# EAGLE design CIRCUIT (EAGLE 9.6.2)
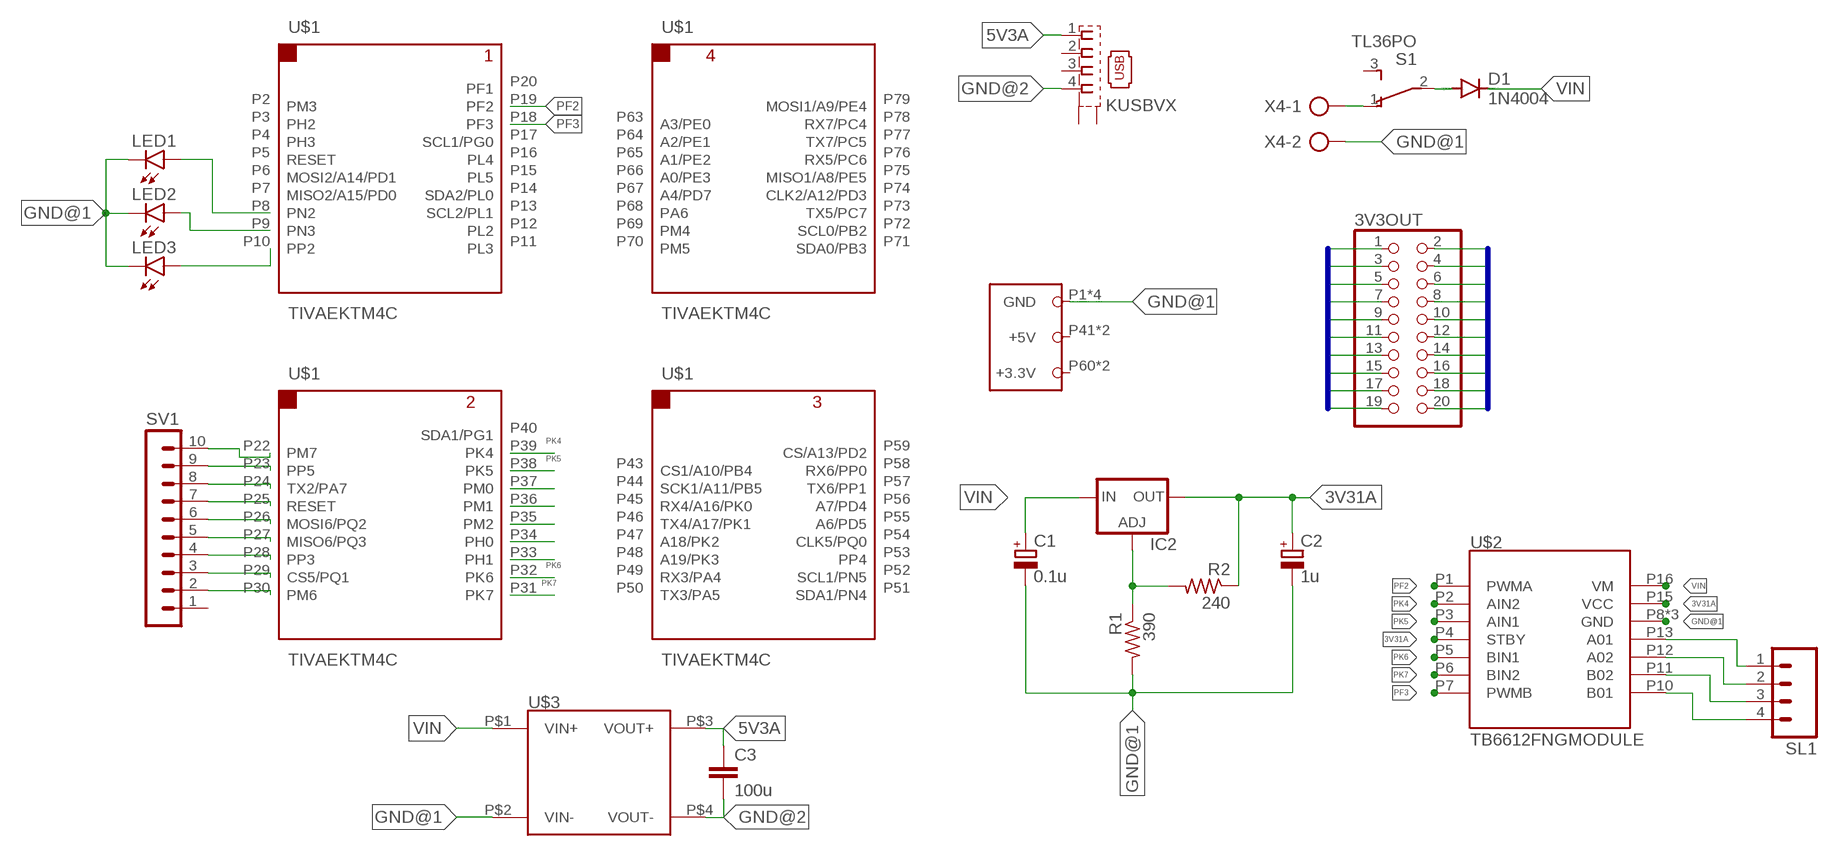
[diagram p0: schematic, sheet 1]

## Parts
3V3OUT  PINHD-2X10  [2X10]
C1  0.1u  CPOL-EUE5-10.5  [E5-10,5]
C2  1u  CPOL-EUE5-10.5  [E5-10,5]
C3  100u  C-EU025-024X044  [C025-024X044]
D1  1N4004  [DO41-10]
IC2  LM317TL  [317TL]
LED1  LED5MM  [LED5MM]
LED2  LED5MM  [LED5MM]
LED3  LED5MM  [LED5MM]
R1  390  R-US_0207/10  [0207/10]
R2  240  R-US_0207/10  [0207/10]
S1  TL36PO  [TL3XPO]
SL1  MA04  [04PA]
SV1  MA10-1  [MA10-1]
U$1  TIVAEKTM4C  [TIVAPINESPCB]
U$2  TB6612FNGMODULE  [TB6612FNG]
U$3  STEPDOWN3A  [REGULADORSTEP-DOWN3/5A]
X1  KUSBVX  [KUSBVX]
X4  AK300/2  [AK300/2]

## Nets
3V31A [outsVoltaje]: 3V3OUT.1 3V3OUT.3 3V3OUT.5 3V3OUT.7 3V3OUT.9 3V3OUT.11 3V3OUT.13 3V3OUT.15 3V3OUT.17 3V3OUT.19 C2.+ IC2.2(OUT) R2.1 U$2.P4(STBY) U$2.P15(VCC)
5V3A [5v3A]: C3.1 U$3.P$3(VOUT+) X1.1
GND@1 [outsVoltaje]: 3V3OUT.2 3V3OUT.4 3V3OUT.6 3V3OUT.8 3V3OUT.10 3V3OUT.12 3V3OUT.14 3V3OUT.16 3V3OUT.18 3V3OUT.20 LED1.K(C) LED2.K(C) LED3.K(C) U$1.P1(GND) U$1.P21(GND) U$1.P42(GND) U$1.P62(GND) U$2.P8(GND) U$2.P9(GND) U$2.P14(GND) U$3.P$2(VIN-) X4.2
GND@2 [5v3A]: C3.2 U$3.P$4(VOUT-) X1.4
N$1 [VInbat]: S1.1(O) X4.1
N$2 [VInbat]: D1.A S1.2(P)
N$3 [VInbat]: IC2.1(ADJ) R1.1 R2.2
N$4: LED3.A U$1.P10(PP2)
N$5: C1.- C2.- R1.2
N$7: LED2.A U$1.P9(PN3)
N$8: LED1.A U$1.P8(PN2)
N$9: SV1.10 U$1.P22(PM7)
N$10: SL1.1 U$2.P13(A01)
N$11: SL1.2 U$2.P12(A02)
N$12: U$1.P37(PM0)
N$13: U$1.P36(PM1)
N$14: U$1.P35(PM2)
N$15: U$1.P34(PH0)
N$16: U$1.P33(PH1)
N$17: SL1.3 U$2.P11(B02)
N$18: SL1.4 U$2.P10(B01)
N$19: SV1.9 U$1.P23(PP5)
N$20: SV1.8 U$1.P24(TX2/PA7)
N$21: SV1.7 U$1.P25(RESET)
N$22: SV1.6 U$1.P26(MOSI6/PQ2)
N$23: SV1.5 U$1.P27(MISO6/PQ3)
N$24: SV1.4 U$1.P28(PP3)
N$25: SV1.3 U$1.P29(CS5/PQ1)
N$26: SV1.2 U$1.P30(PM6)
PF2: U$1.P19(PF2) U$2.P1(PWMA)
PF3: U$1.P18(PF3) U$2.P7(PWMB)
PK4 [TivaPins]: U$1.P39(PK4) U$2.P2(AIN2)
PK5 [TivaPins]: U$1.P38(PK5) U$2.P3(AIN1)
PK6 [TivaPins]: U$1.P32(PK6) U$2.P5(BIN1)
PK7 [TivaPins]: U$1.P31(PK7) U$2.P6(BIN2)
VIN [VInbat]: C1.+ D1.C IC2.3(IN) U$2.P16(VM) U$3.P$1(VIN+)
Unconnected: S1.3(S) SV1.1 U$1.P2(PM3) U$1.P3(PH2) U$1.P4(PH3) U$1.P5(RESET) U$1.P6(MOSI2/A14/PD1) U$1.P7(MISO2/A15/PD0) U$1.P11(PL3) U$1.P12(PL2) U$1.P13(SCL2/PL1) U$1.P14(SDA2/PL0) U$1.P15(PL5) U$1.P16(PL4) U$1.P17(SCL1/PG0) U$1.P20(PF1) U$1.P40(SDA1/PG1) U$1.P41(+5V) U$1.P43(CS1/A10/PB4) U$1.P44(SCK1/A11/PB5) U$1.P45(RX4/A16/PK0) U$1.P46(TX4/A17/PK1) U$1.P47(A18/PK2) U$1.P48(A19/PK3) U$1.P49(RX3/PA4) U$1.P50(TX3/PA5) U$1.P51(SDA1/PN4) U$1.P52(SCL1/PN5) U$1.P53(PP4) U$1.P54(CLK5/PQ0) U$1.P55(A6/PD5) U$1.P56(A7/PD4) U$1.P57(TX6/PP1) U$1.P58(RX6/PP0) U$1.P59(CS/A13/PD2) U$1.P60(+3.3V) U$1.P61(+5V) U$1.P63(A3/PE0) U$1.P64(A2/PE1) U$1.P65(A1/PE2) U$1.P66(A0/PE3) U$1.P67(A4/PD7) U$1.P68(PA6) U$1.P69(PM4) U$1.P70(PM5) U$1.P71(SDA0/PB3) U$1.P72(SCL0/PB2) U$1.P73(TX5/PC7) U$1.P74(CLK2/A12/PD3) U$1.P75(MISO1/A8/PE5) U$1.P76(RX5/PC6) U$1.P77(TX7/PC5) U$1.P78(RX7/PC4) U$1.P79(MOSI1/A9/PE4) U$1.P80(+3.3V) X1.2 X1.3 X1.M1(S1) X1.M2(S2)

## Buses
GNDS:GND@1
3V31AS:3V31A

## Library data of the parts
3V3OUT = pinhead:PINHD-2X10: PIN HEADER
C1 C2 = rcl:CPOL-EU: POLARIZED CAPACITOR, European symbol; SPICEPREFIX: C
C3 = rcl:C-EU: CAPACITOR, European symbol; SPICEPREFIX: C
D1 = diode:1N4004: DIODE general purpose rectifier, 1 A
IC2 = v-reg:LM317TL: VOLTAGE REGULATOR
LED1-LED3 = led:LED: LED OSRAM: - CHIPLED LG R971, LG N971, LY N971, LG Q971, LY Q971, LO R971, LY R971 LH N974, LH R974 LS Q976, LO Q976, LY Q976 LO Q996 - Hyper CHIPLED LW Q18S LB Q993, LB Q99A, LB R99A - SideLED LS A670, LO A670, LY A670, LG A670, LP A670 LB A673, LV A673, LT A673, LW A673 LH A674 LY A675 LS A676, LA A676, LO A676, LY A676, LW A676 LS A679, LY A679, LG A679 - Hyper Micro SIDELED® LS Y876, LA Y876, LO Y876, LY Y876 LT Y87S - SmartLED LW L88C, LW L88S LB L89C, LB L89S, LG L890 LS L89K, LO L89K, LY L89K LS L896, LA L896, LO L896, LY L896 - TOPLED LS T670, LO T670, LY T670, LG T670, LP T670 LSG T670, LSP T670, LSY T670, LOP T670, LYG T670 LG T671, LOG T671, LSG T671 LB T673, LV T673, LT T673, LW T673 LH T674 LS T676, LA T676, LO T676, LY T676, LB T676, LH T676, LSB T676, LW T676 LB T67C, LV T67C, LT T67C, LS T67K, LO T67K, LY T67K, LW E67C LS E67B, LA E67B, LO E67B, LY E67B, LB E67C, LV E67C, LT E67C LW T67C LS T679, LY T679, LG T679 LS T770, LO T770, LY T770, LG T770, LP T770 LB T773, LV T773, LT T773, LW T773 LH T774 LS E675, LA E675, LY E675, LS T675 LS T776, LA T776, LO T776, LY T776, LB T776 LHGB T686 LT T68C, LB T68C - Hyper Mini TOPLED® LB M676 - Mini TOPLED Santana® LG M470 LS M47K, LO M47K, LY M47K Source: http://www.osram.convergy.de LUXEON: - LUMILED® LXK2-PW12-R00, LXK2-PW12-S00, LXK2-PW14-U00, LXK2-PW14-V00 LXK2-PM12-R00, LXK2-PM12-S00, LXK2-PM14-U00 LXK2-PE12-Q00, LXK2-PE12-R00, LXK2-PE12-S00, LXK2-PE14-T00, LXK2-PE14-U00 LXK2-PB12-K00, LXK2-PB12-L00, LXK2-PB12-M00, LXK2-PB14-N00, LXK2-PB14-P00, LXK2-PB14-Q00 LXK2-PR12-L00, LXK2-PR12-M00, LXK2-PR14-Q00, LXK2-PR14-R00 LXK2-PD12-Q00, LXK2-PD12-R00, LXK2-PD12-S00 LXK2-PH12-R00, LXK2-PH12-S00 LXK2-PL12-P00, LXK2-PL12-Q00, LXK2-PL12-R00 Source: www.luxeon.com KINGBRIGHT: KA-3528ASYC Source: www.kingbright.com
R1 R2 = rcl:R-US_: RESISTOR, American symbol; SPICEPREFIX: R
S1 = switch:TL36PO: TINY SWITCH ON - ON Source: http://www2.produktinfo.conrad.com/datenblaetter/700000-724999/705152-da-01-de-Subminiaturschalter_TL_36YO.pdf
SL1 = con-amp-quick:MA04: AMP QUICK CONNECTOR; OC_FARNELL: unknown; OC_NEWARK: unknown
SV1 = con-lstb:MA10-1: PIN HEADER; OC_FARNELL: unknown; OC_NEWARK: unknown
U$1 = TivaConnector:TIVAEKTM4C
U$2 = Drivers:TB6612FNGMODULE
U$3 = ReguladoresStep:STEPDOWN3A
X1 = con-kycon:KUSBVX: Vertical,Top Entry Universal Serial Bus Connector KUSBVX Series Source: KYCON Sibalco USB vertical socket KUSBV.pdf
X4 = con-ptr500:AK300/2: CONNECTOR; OC_FARNELL: unknown; OC_NEWARK: unknown

## Net classes
0 default: width 0.381 mm, drill 0.203 mm, clearance 1.27 mm
1 RasPins: drill 8 mm, clearance 1.27 mm
2 TivaPins: width 0.381 mm, drill 0.203 mm, clearance 1.27 mm
3 VInbat: width 1.27 mm, drill 0.406 mm, clearance 1.27 mm
4 5v3A: width 1.27 mm, drill 0.508 mm, clearance 1.27 mm
5 outsVoltaje: width 0.635 mm, drill 0.203 mm, clearance 1.27 mm

## Board
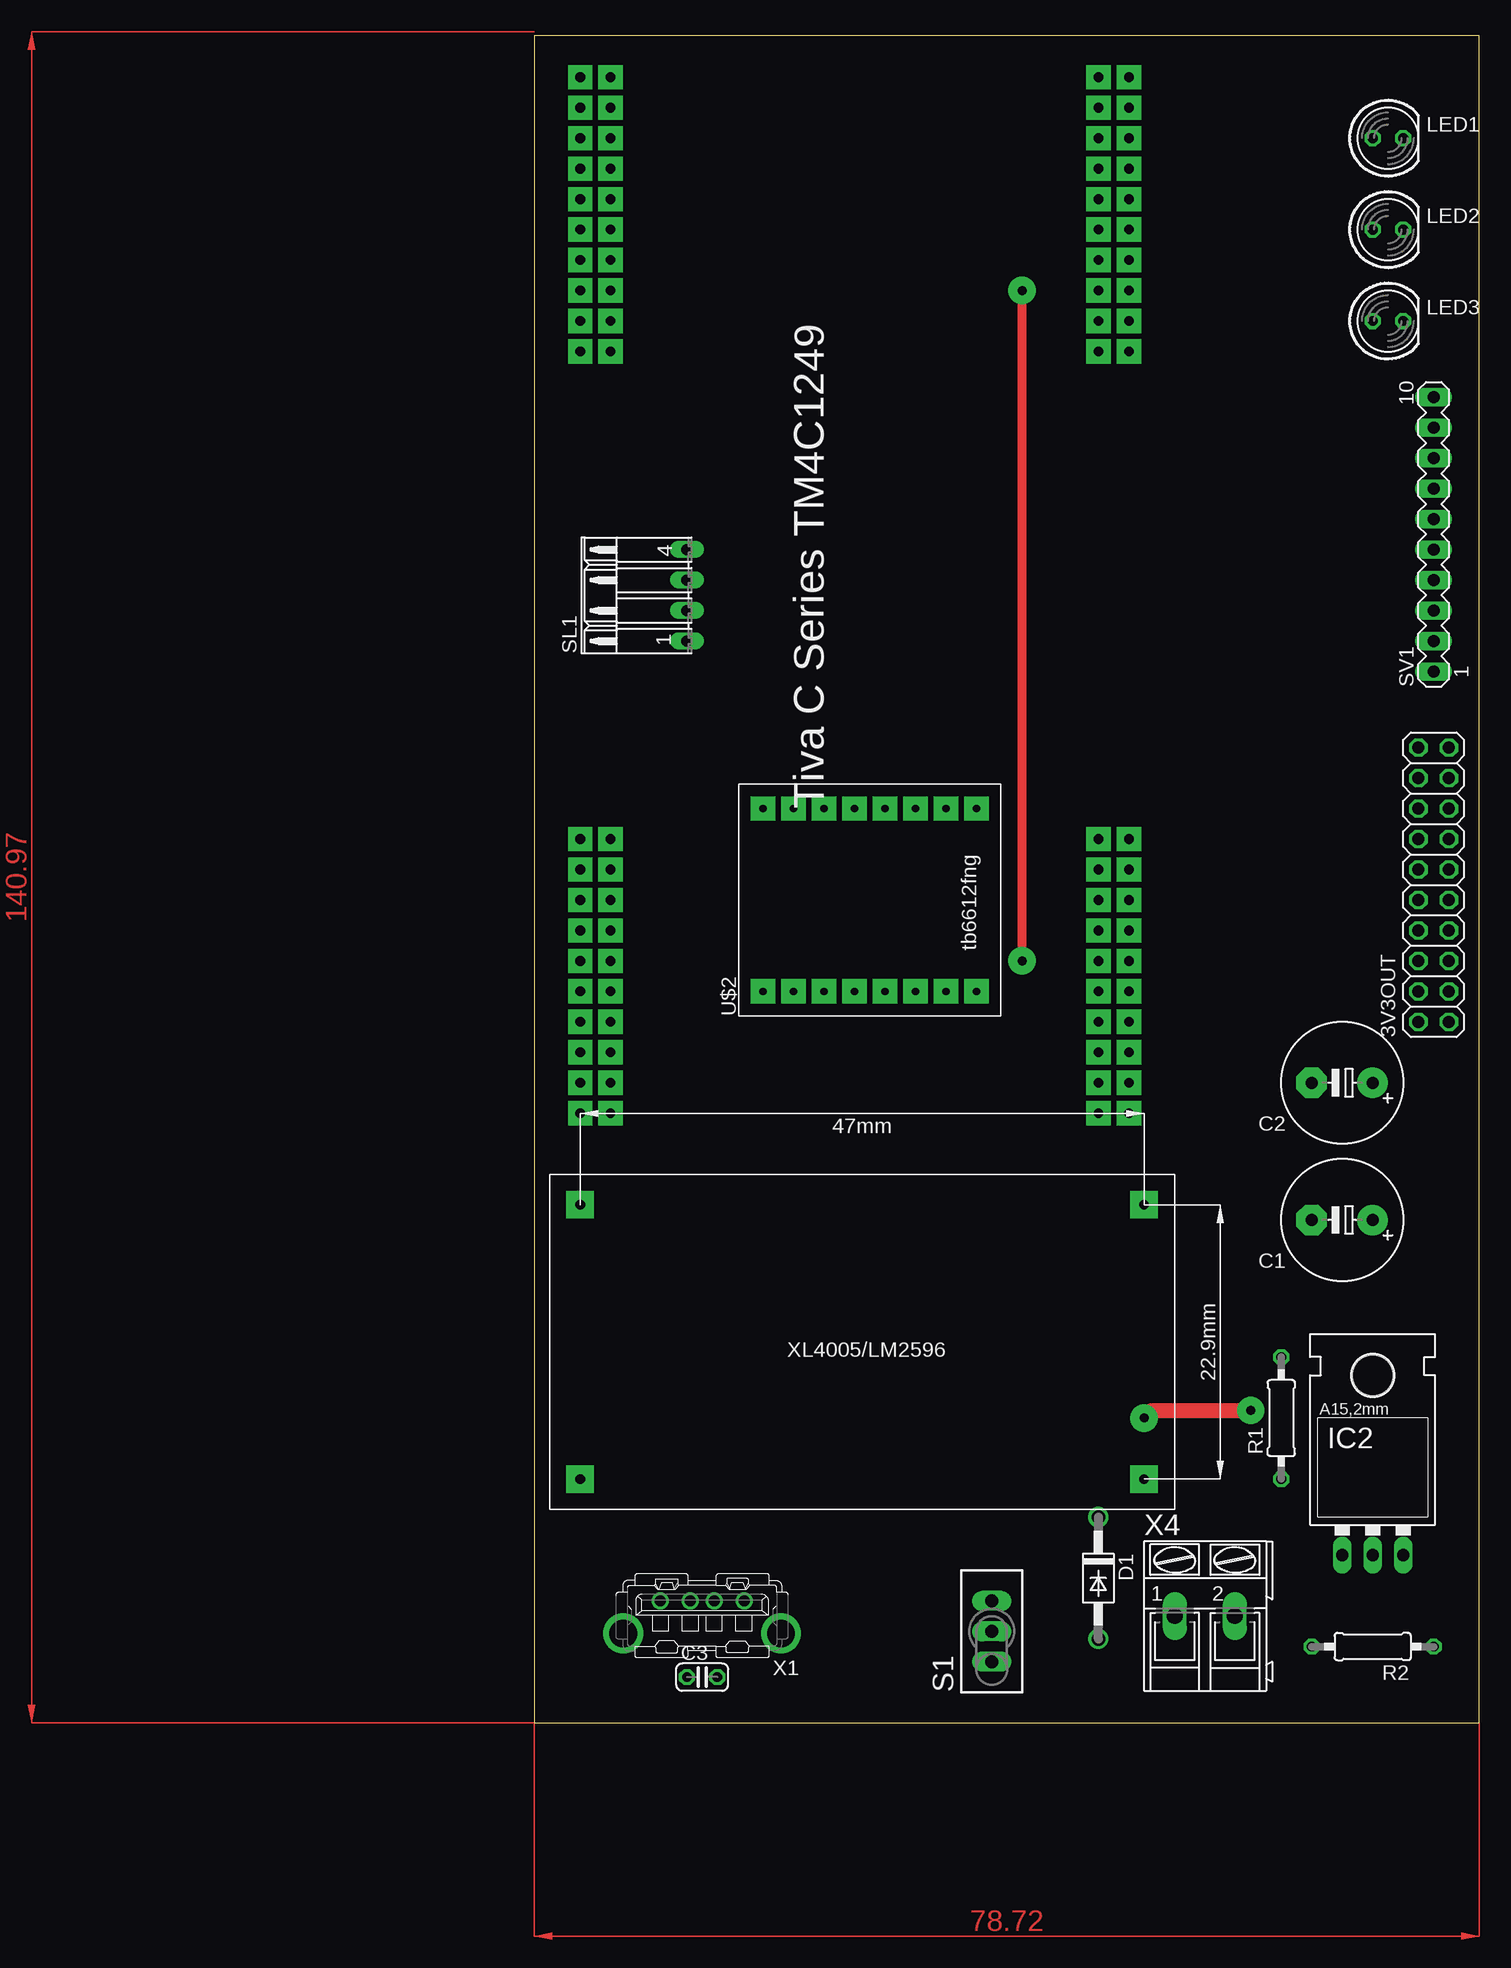
[diagram p1: board, top side]
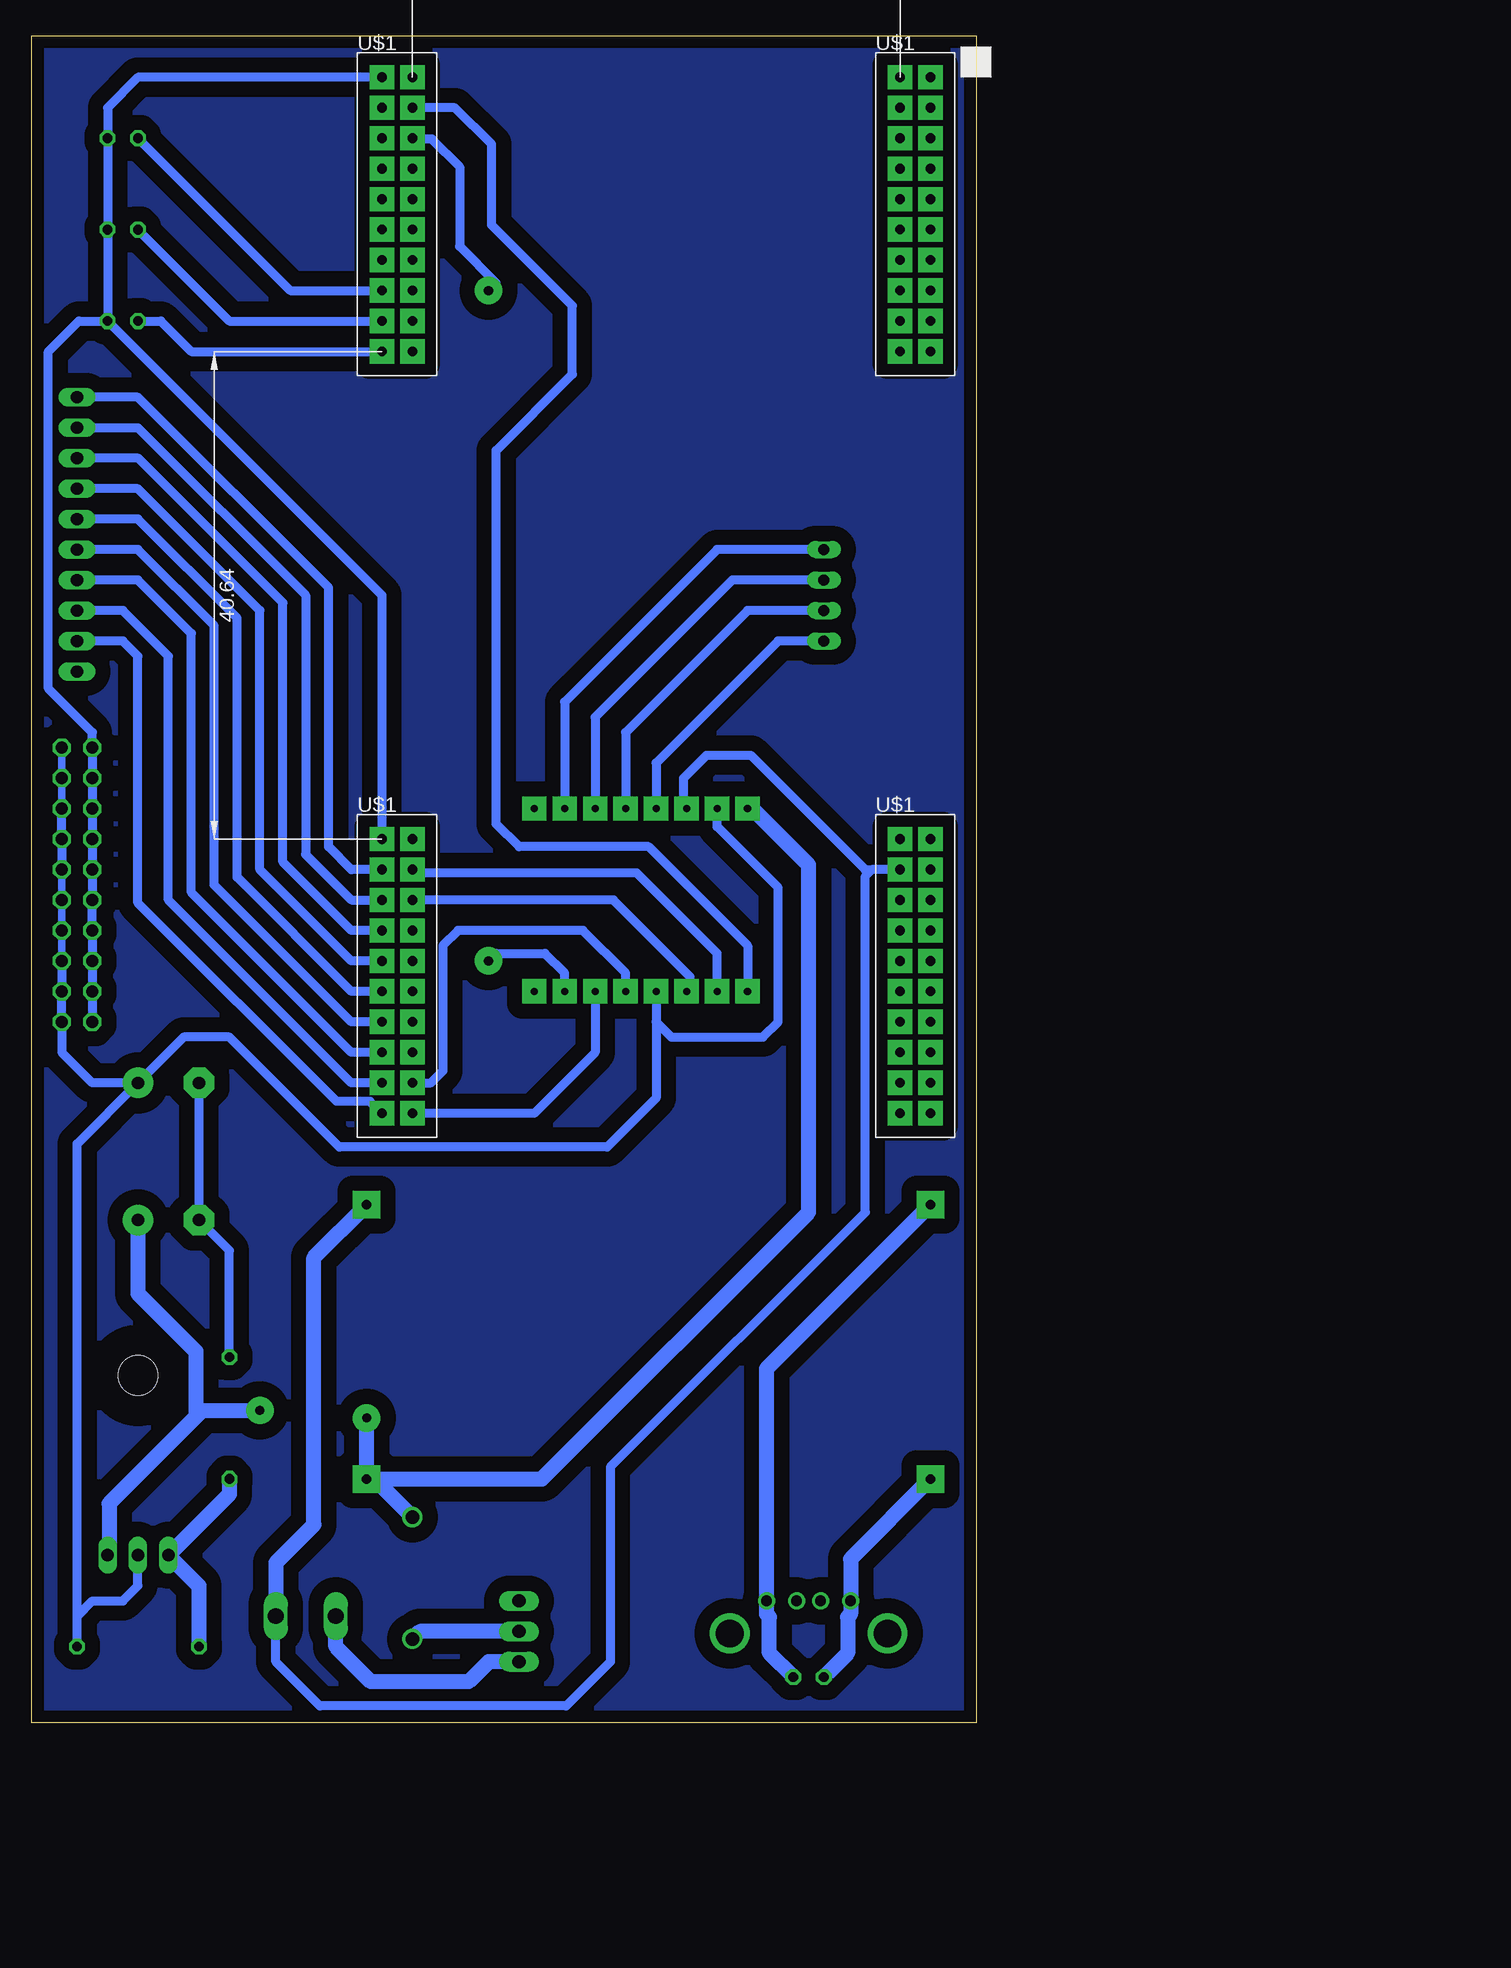
[diagram p2: board, bottom side, seen from below]

Size 78.72 x 140.64 mm. Coordinates in mm from the lower left corner, seen from the top.
Outline: 0,0 78.72,0 78.72,140.64 0,140.64 0,0
Copper layers (1*16): Top 0.035mm / dielectric 1.5mm / Bottom 0.035mm
Design rules "default": minimum track width 6mil, minimum drill 0.35mm, track to track 6mil, track to pad 6mil, pad to pad 6mil, via to via 6mil, smd to smd 6mil, copper to edge 40mil, drill to drill 6mil, minimum pad ring 10mil, minimum via ring 8mil, stop-mask expansion 4mil, vias tented up to drill 0mil, thermal gap 10mil

### Footprints (pad centres in the part's own frame; a part is rotated, then mirrored left to right if it is on the bottom)
2X10 = drill 1.016 octagon: 1 -11.43,-1.27; 2 -11.43,1.27; 3 -8.89,-1.27; 4 -8.89,1.27; 5 -6.35,-1.27; 6 -6.35,1.27; 7 -3.81,-1.27; 8 -3.81,1.27; 9 -1.27,-1.27; 10 -1.27,1.27; 11 1.27,-1.27; 12 1.27,1.27; 13 3.81,-1.27; 14 3.81,1.27; 15 6.35,-1.27; 16 6.35,1.27; 17 8.89,-1.27; 18 8.89,1.27; 19 11.43,-1.27; 20 11.43,1.27
E5-10,5 = drill 1.016 pad 2.54: + -2.54,0 | drill 1.016 pad 2.54 octagon: - 2.54,0
C025-024X044 = drill 0.813 octagon: 1 -1.27,0; 2 1.27,0
DO41-10 = drill 1.118: A 5.08,0; C -5.08,0
317TL = drill 1.016 long: 1 -2.54,-3.81; 2 0,-3.81; 3 2.54,-3.81 | hole 3.302: 0,11.176
LED5MM = drill 0.813 octagon: A -1.27,0; K 1.27,0
0207/10 = drill 0.813 octagon: 1 -5.08,0; 2 5.08,0
TL3XPO = drill 1.1 pad 1.422 long: 1 -2.54,0; 2 0,0; 3 2.54,0
04PA = drill 0.914 long: 1 -3.81,0; 2 -1.27,0; 3 1.27,0; 4 3.81,0
MA10-1 = drill 1.016 long: 1 -11.43,0; 2 -8.89,0; 3 -6.35,0; 4 -3.81,0; 5 -1.27,0; 6 1.27,0; 7 3.81,0; 8 6.35,0; 9 8.89,0; 10 11.43,0
TIVAPINESPCB = drill 0.8 pad 2.032 square: P1 -1.27,11.43; P2 -1.27,8.89; P3 -1.27,6.35; P4 -1.27,3.81; P5 -1.27,1.27; P6 -1.27,-1.27; P7 -1.27,-3.81; P8 -1.27,-6.35; P9 -1.27,-8.89; P10 -1.27,-11.43; P11 1.27,-11.43; P12 1.27,-8.89; P13 1.27,-6.35; P14 1.27,-3.81; P15 1.27,-1.27; P16 1.27,1.27; P17 1.27,3.81; P18 1.27,6.35; P19 1.27,8.89; P20 1.27,11.43; P21 -1.27,-52.07; P22 -1.27,-54.61; P23 -1.27,-57.15; P24 -1.27,-59.69; P25 -1.27,-62.23; P26 -1.27,-64.77; P27 -1.27,-67.31; P28 -1.27,-69.85; P29 -1.27,-72.39; P30 -1.27,-74.93; P31 1.27,-74.93; P32 1.27,-72.39; P33 1.27,-69.85; P34 1.27,-67.31; P35 1.27,-64.77; P36 1.27,-62.23; P37 1.27,-59.69; P38 1.27,-57.15; P39 1.27,-54.61; P40 1.27,-52.07; P41 41.91,-52.07; P42 41.91,-54.61; P43 41.91,-57.15; P44 41.91,-59.69; P45 41.91,-62.23; P46 41.91,-64.77; P47 41.91,-67.31; P48 41.91,-69.85; P49 41.91,-72.39; P50 41.91,-74.93; P51 44.45,-74.93; P52 44.45,-72.39; P53 44.45,-69.85; P54 44.45,-67.31; P55 44.45,-64.77; P56 44.45,-62.23; P57 44.45,-59.69; P58 44.45,-57.15; P59 44.45,-54.61; P60 44.45,-52.07; P61 41.91,11.43; P62 41.91,8.89; P63 41.91,6.35; P64 41.91,3.81; P65 41.91,1.27; P66 41.91,-1.27; P67 41.91,-3.81; P68 41.91,-6.35; P69 41.91,-8.89; P70 41.91,-11.43; P71 44.45,-11.43; P72 44.45,-8.89; P73 44.45,-6.35; P74 44.45,-3.81; P75 44.45,-1.27; P76 44.45,1.27; P77 44.45,3.81; P78 44.45,6.35; P79 44.45,8.89; P80 44.45,11.43
TB6612FNG = drill 0.6 pad 2.032 square: P1 -7.62,8.89; P2 -7.62,6.35; P3 -7.62,3.81; P4 -7.62,1.27; P5 -7.62,-1.27; P6 -7.62,-3.81; P7 -7.62,-6.35; P8 -7.62,-8.89; P9 7.62,-8.89; P10 7.62,-6.35; P11 7.62,-3.81; P12 7.62,-1.27; P13 7.62,1.27; P14 7.62,3.81; P15 7.62,6.35; P16 7.62,8.89
REGULADORSTEP-DOWN3/5A = drill 0.8 pad 2.286 square: P$1 0,0; P$2 0,-22.86; P$3 46.99,0; P$4 46.99,-22.86
KUSBVX = drill 0.9 pad 1.3: 1 3.5,0; 2 1,0; 3 -1,0; 4 -3.5,0 | drill 2.3 pad 2.8: M1 -6.57,2.71; M2 6.57,2.71
AK300/2 = drill 1.321 long: 1 -2.515,0; 2 2.489,0

### Placement (x,y rotation side)
3V3OUT  74.93,69.85 90 top
C1  67.31,41.91 180 top
C2  67.31,53.34 180 top
C3  13.97,3.81 0 top
D1  46.99,12.06 270 top
IC2  69.85,17.78 0 top
LED1  71.12,132.08 0 top
LED2  71.12,124.46 0 top
LED3  71.12,116.84 0 top
R1  62.23,25.4 90 top
R2  69.85,6.35 180 top
S1  38.1,7.62 90 top
SL1  12.7,93.98 90 top
SV1  74.93,99.06 90 top
U$1  48.26,125.73 0 bottom
U$2  27.94,68.58 90 top
U$3  50.8,20.32 180 top
X1  13.97,10.16 180 top
X4  55.88,8.89 0 top

### Tracks (layer width: path | path; a pad name or v marks a point on that pad's centre or on a via)
3V31A
  Bottom 0.635: 3V3OUT.15 3V3OUT.17 3V3OUT.19 | 3V3OUT.11 3V3OUT.9 3V3OUT.7 3V3OUT.5
  Bottom 0.762: R2.1 74.93,8.89 | 74.93,8.89 73.66,10.16 71.12,10.16 69.85,11.43 IC2.2 | 74.93,8.89 74.93,48.26 C2.+ | C2.+ 73.66,53.34 76.2,55.88 3V3OUT.1 3V3OUT.3 3V3OUT.5 | 3V3OUT.11 3V3OUT.13 3V3OUT.15 | U$2.P15 21.59,74.68 16.51,69.6 16.51,58.42 17.78,57.15 25.4,57.15 26.67,58.42 U$2.P4 26.67,52.07 30.76,47.98 53.06,47.98 62.23,57.15 66.04,57.15 C2.+
5V3A
  Bottom 0.762: 12.38,4.13 C3.1
  Bottom 1.27: U$3.P$3 10.47,13.66 X1.1 10.47,9.06 10.71,8.82 10.71,5.8 12.38,4.13
DISIPATE
  pour Bottom: 0,140.97 78.74,140.97 78.74,0 0,0
GND@1
  Bottom 0.762: 3V3OUT.2 3V3OUT.4 3V3OUT.6 3V3OUT.8 3V3OUT.10 3V3OUT.12 3V3OUT.14 3V3OUT.16 3V3OUT.18 3V3OUT.20 73.66,82.55 77.32,86.21 77.32,114.3 74.78,116.84 LED3.K | U$1.P1 69.85,137.16 72.39,134.62 LED1.K LED2.K LED3.K | U$2.P14 24.41,76.48 24.41,78.71 22.45,80.66 18.8,80.66 9.26,71.12 8.7,71.12 | LED3.K 49.53,93.98 U$1.P21 | X4.2 58.37,5.08 54.69,1.4 34.16,1.4 30.48,5.08 30.48,21.31 9.25,42.55 9.25,70.58 8.7,71.12 | U$1.P42 8.7,71.12
  Bottom 1.27: X4.2 58.37,13.33 55.19,16.51 55.19,38.79 U$3.P$2
GND@2
  Bottom 1.27: C3.2 17.23,5.8 17.23,8.82 17.47,9.06 X1.4 17.47,29.52 U$3.P$4
N$1
  Bottom 1.27: S1.1 40.64,5.08 42.29,3.43 50.44,3.43 53.36,6.35 X4.1
N$2
  Bottom 1.27: S1.2 46.35,7.62 D1.A
N$3
  Bottom 1.27: R1.1 62.23,19.05 IC2.1 64.77,11.43 R2.2
N$4
  Bottom 0.762: LED3.A 67.94,116.84 65.41,114.3 U$1.P10
N$5
  Bottom 0.762: C2.- C1.- 62.23,39.37 R1.2
N$7
  Bottom 0.762: LED2.A 62.23,116.84 U$1.P9
N$8
  Bottom 0.762: LED1.A 57.15,119.38 U$1.P8
N$9
  Bottom 0.762: U$1.P22 52.07,71.12 53.97,73.03 53.97,94.61 69.85,110.49 SV1.10
N$10
  Bottom 0.762: SL1.1 16.51,90.17 26.67,80.01 U$2.P13
N$11
  Bottom 0.762: SL1.2 19.05,92.71 29.21,82.55 U$2.P12
N$17
  Bottom 0.762: SL1.3 20.32,95.25 31.75,83.82 U$2.P11
N$18
  Bottom 0.762: SL1.4 21.59,97.79 34.29,85.09 U$2.P10
N$19
  Bottom 0.762: SV1.9 69.85,107.95 55.88,93.98 55.88,72.39 52.07,68.58 U$1.P23
N$20
  Bottom 0.762: U$1.P24 52.07,66.04 57.78,71.75 57.78,93.37 69.83,105.41 SV1.8
N$21
  Bottom 0.762: U$1.P25 52.07,63.5 59.69,71.12 59.69,92.71 69.85,102.87 SV1.7
N$22
  Bottom 0.762: U$1.P26 52.07,60.96 61.59,70.48 61.59,92.08 69.85,100.33 SV1.6
N$23
  Bottom 0.762: U$1.P27 52.07,58.42 63.5,69.85 63.5,91.44 69.85,97.79 SV1.5
N$24
  Bottom 0.762: SV1.4 69.85,95.25 65.41,90.81 65.41,69.22 52.07,55.88 U$1.P28
N$25
  Bottom 0.762: U$1.P29 52.07,53.34 67.31,68.58 67.31,88.9 71.12,92.71 SV1.3
N$26
  Bottom 0.762: U$1.P30 50.52,51.79 53.31,51.79 69.85,68.33 69.85,88.9 71.12,90.17 SV1.2
PF2
  Bottom 0.762: U$2.P1 19.05,64.77 27.3,73.03 38.1,73.03 40,74.93 40,106.05 33.66,112.39 33.66,118.11 40.39,124.84 40.39,131.57 43.43,134.62 U$1.P19
PF3  (via drill 0.76 pad 2.29)
  Top 0.762: v40.64,63.5 v40.64,119.38
  Bottom 0.381: 46.93,132.02 U$1.P18
  Bottom 0.762: v40.64,119.38 40,120.02 43.05,123.06 43.05,129.7 45.37,132.02 46.93,132.02 | U$2.P7 34.29,62.48 35.95,64.13 40,64.13 v40.64,63.5
PK4
  Bottom 0.762: U$2.P2 21.59,64.13 28.32,70.87 46.74,70.87 U$1.P39
PK5
  Bottom 0.762: U$2.P3 23.85,61.24 23.85,62.2 30.23,68.58 U$1.P38
PK6
  Bottom 0.762: U$2.P5 29.21,62.48 32.77,66.04 43.18,66.04 44.45,64.77 44.45,54.33 45.44,53.34 U$1.P32
PK7
  Bottom 0.762: U$2.P6 31.75,55.88 36.83,50.8 U$1.P31
VIN  (via drill 0.76 pad 2.29)
  Top 1.27: v50.8,25.4 51.43,26.03 v59.69,26.03
  Bottom 0.762: 72.41,14 IC2.3
  Bottom 1.27: U$3.P$1 50.16,20.32 D1.C | U$3.P$1 36.19,20.32 13.97,42.55 13.97,71.5 18.67,76.2 U$2.P16 | 72.41,14 72.26,14.15 72.26,18.27 65.02,25.51 | C1.+ 69.85,35.78 65.02,30.95 65.02,25.51 | 65.02,25.51 64.5,26.03 v59.69,26.03 | U$3.P$1 v50.8,25.4
(copper drawn outside any net)
  shapes: Top area x2